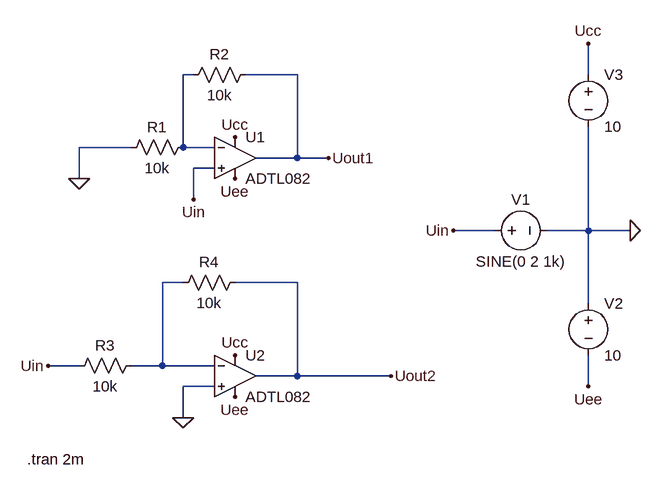
[diagram p0: schematic Zadanie1.asc]
Zadanie1.asc, the LTspice schematic file:
Version 4.1
SHEET 1 884 688
WIRE -64 80 -80 80
WIRE 96 80 16 80
WIRE 544 80 544 32
WIRE -160 192 -240 192
WIRE -80 192 -80 80
WIRE -32 192 -80 192
WIRE 96 208 96 80
WIRE 96 208 32 208
WIRE 144 208 96 208
WIRE -32 224 -64 224
WIRE -240 240 -240 192
WIRE -64 272 -64 224
WIRE 400 320 336 320
WIRE 544 320 544 160
WIRE 544 320 480 320
WIRE 608 320 544 320
WIRE -80 400 -112 400
WIRE 96 400 0 400
WIRE 544 432 544 320
WIRE -240 528 -288 528
WIRE -112 528 -112 400
WIRE -112 528 -160 528
WIRE -32 528 -112 528
WIRE 96 544 96 400
WIRE 96 544 32 544
WIRE 240 544 96 544
WIRE -32 560 -80 560
WIRE 544 560 544 512
WIRE -80 608 -80 560
FLAG -240 240 0
FLAG -64 272 Uin
FLAG 0 240 Uee
FLAG 0 176 Ucc
FLAG 144 208 Uout1
FLAG 0 512 Ucc
FLAG 0 576 Uee
FLAG -80 608 0
FLAG -288 528 Uin
FLAG 240 544 Uout2
FLAG 336 320 Uin
FLAG 544 560 Uee
FLAG 608 320 0
FLAG 544 32 Ucc
SYMBOL res -64 176 R90
WINDOW 0 0 56 VBottom 2
WINDOW 3 32 56 VTop 2
SYMATTR InstName R1
SYMATTR Value 10k
SYMBOL OpAmps\\ADTL082 0 144 R0
SYMATTR InstName U1
SYMBOL res 32 64 R90
WINDOW 0 0 56 VBottom 2
WINDOW 3 32 56 VTop 2
SYMATTR InstName R2
SYMATTR Value 10k
SYMBOL OpAmps\\ADTL082 0 480 R0
SYMATTR InstName U2
SYMBOL res -144 512 R90
WINDOW 0 0 56 VBottom 2
WINDOW 3 32 56 VTop 2
SYMATTR InstName R3
SYMATTR Value 10k
SYMBOL res 16 384 R90
WINDOW 0 0 56 VBottom 2
WINDOW 3 32 56 VTop 2
SYMATTR InstName R4
SYMATTR Value 10k
SYMBOL voltage 384 320 R270
WINDOW 0 32 56 VTop 2
WINDOW 3 -32 56 VBottom 2
WINDOW 123 0 0 Left 0
WINDOW 39 0 0 Left 0
SYMATTR InstName V1
SYMATTR Value SINE(0 2 1k)
SYMBOL voltage 544 416 R0
WINDOW 123 0 0 Left 0
WINDOW 39 0 0 Left 0
SYMATTR InstName V2
SYMATTR Value 10
SYMBOL voltage 544 64 R0
WINDOW 123 0 0 Left 0
WINDOW 39 0 0 Left 0
SYMATTR InstName V3
SYMATTR Value 10
TEXT -320 672 Left 2 !.tran 2m

The netlist it stands for:
* Zadanie1.asc
R1 N001 0 10k
X§U1 Uin N001 Ucc Uee Uout1 ADTL082  ; pins In+ In- V+ V- OUT
R2 Uout1 N001 10k
X§U2 0 N002 Ucc Uee Uout2 ADTL082  ; pins In+ In- V+ V- OUT
R3 N002 Uin 10k
R4 Uout2 N002 10k
V1 Uin 0 SINE(0 2 1k)
V2 0 Uee 10
V3 Ucc 0 10
.tran 2m
.lib ADI.lib
.backanno
.end